# EAGLE design rev1.0 (EAGLE 9.2.2)
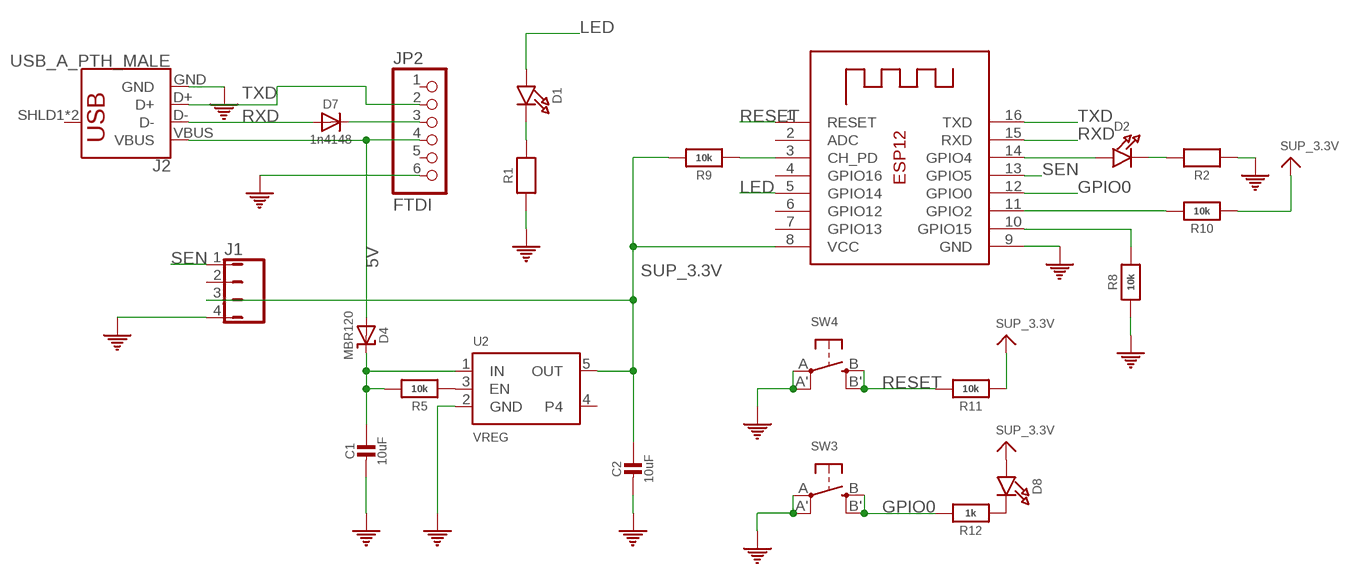
[diagram p0: schematic, sheet 1]

## Parts
C1  10uF  CAP_CERAMIC0805-NOOUTLINE  [0805-NO]
C2  10uF  CAP_CERAMIC0805-NOOUTLINE  [0805-NO]
D1  LED0805_NOOUTLINE  [CHIPLED_0805_NOOUTLINE]
D2  LED0805_NOOUTLINE  [CHIPLED_0805_NOOUTLINE]
D4  MBR120  DIODE-SCHOTTKYSOD-123  [SOD-123]
D7  1n4148  DIODESOD-323  [SOD-323]
D8  LED0805_NOOUTLINE  [CHIPLED_0805_NOOUTLINE]
J1  JMP/4P/SIP  [JMP/4P/SIP]
J2  USB_A_PTH_MALE  [USB-A-H]
JP2  FTDI  HEADER-1X670MIL  [1X06_ROUND_70]
R1  RESISTOR0805_NOOUTLINE  [0805-NO]
R2  RESISTOR0805_NOOUTLINE  [0805-NO]
R5  10k  RESISTOR0805_NOOUTLINE  [0805-NO]
R8  10k  RESISTOR0805_NOOUTLINE  [0805-NO]
R9  10k  RESISTOR0805_NOOUTLINE  [0805-NO]
R10  10k  RESISTOR0805_NOOUTLINE  [0805-NO]
R11  10k  RESISTOR0805_NOOUTLINE  [0805-NO]
R12  1k  RESISTOR0805_NOOUTLINE  [0805-NO]
SW3  SWITCH_TACT_SMT4.6X2.8  [BTN_KMR2_4.6X2.8]
SW4  SWITCH_TACT_SMT4.6X2.8  [BTN_KMR2_4.6X2.8]
U2  VREG  VREG_SOT23-5  [SOT23-5]
X1  ESP-12  [ESP-12]

## Nets
5V: D4.A J2.VBUS JP2.4
GND: C1.2 C2.2 J1.4 J2.GND JP2.6 R1.1 R2.1 R8.1 SW3.A'(P1) SW3.A(P) SW4.A'(P1) SW4.A(P) U2.2(GND) X1.9(GND)
GPIO0: R12.2 SW3.B'(S1) SW3.B(S) X1.12(GPIO0)
GPIO15: R8.2 X1.10(GPIO15)
LED: D1.A X1.5(GPIO14)
N$1: D1.C R1.2
N$2: D2.A X1.14(GPIO4)
N$3: D8.C R12.1
N$4: R5.1 U2.3(EN)
N$5: D7.C JP2.3
N$6: C1.1 D4.C R5.2 U2.1(IN)
N$7: D2.C R2.2
N$8: R10.2 X1.11(GPIO2)
N$9: R9.1 X1.3(CH_PD)
RESET: R11.2 SW4.B'(S1) SW4.B(S) X1.1(RESET)
RXD: D7.A J2.D- X1.15(RXD)
SEN: J1.1 X1.13(GPIO5)
SUP_3.3V: C2.1 D8.A J1.3 R9.2 R10.1 R11.1 U2.5(OUT) X1.8(VCC)
TXD: J2.D+ JP2.2 X1.16(TXD)
Unconnected: J1.2 J2.SHLD1(SHIELD) J2.SHLD2(SHIELD) JP2.1 JP2.5 U2.4 X1.2(ADC) X1.4(GPIO16) X1.6(GPIO12) X1.7(GPIO13)

## Library data of the parts
C1 C2 = ddh:CAP_CERAMIC: Ceramic Capacitors For new designs, use the packages preceded by an '_' character since they are more reliable: The following footprints should be used on most boards: _0402 - Standard footprint for regular board layouts _0603 - Standard footprint for regular board layouts _0805 - Standard footprint for regular board layouts _1206 - Standard footprint for regular board layouts For extremely tight-pitch boards where space is at a premium, the following 'micro-pitch' footprints can be used (smaller pads, no silkscreen outline, etc.): _0402MP - Micro-pitch footprint for very dense/compact boards _0603MP - Micro-pitch footprint for very dense/compact boards _0805MP - Micro-pitch footprint for very dense/compact boards _1206MP - Micro-pitch footprint for very dense/compact boards
D1 D2 D8 = ddh:LED: LED 0603 - 0603 Surface Mount Package 2mA: Green LED - Low Power (3.9mcd, 2ma, 1.7Vf) - Digikey: 475-2709-2-ND Orange LED - Low Power (9.8mcd, 2ma, 1.8Vf) - Digikey: 475-1194-2-ND Red LED - Low Power (5mcd, 2ma, 1.8Vf) - Digikey: 475-1195-2-ND Yellow LED - Low Power (7mcd, 2ma, 1.8Vf) - Digikey: 475-1196-2-ND 5mA: Blue LED - Low Power (17mcd, 5ma, 2.9Vf) - Digikey: LNJ937W8CRACT-ND 0805 - 0805 Surface Mount Package 2mA: Red LED (8.8mcd, 2mA, 1.8Vf, Clear) - Low Power [Digikey: 475-2510-1-ND] Green LED (5mcd, 2mA, 1.8Vf, Clear) - Low Power [Digikey: 475-2730-1-ND] Yellow LED (11.3mcd, 2mA, 1.8Vf, Clear) - Low Power [Digikey: 475-2555-1-ND] 20mA: Red LED (104mcd, 20mA, Diffused) - LS R976 [Digikey: 475-1278-6-ND] Red LED (12mcd, 20mA, 2.0Vf, Clear) - APT2012EC [Digikey: 754-1128-1-ND] Green LED (15mcd, 20mA, 2.2Vf, Clear) - APT2012GC [Digikey: 754-1131-1-ND] Orange LED (160mcd, 20mA, 2.1Vf, Clear) - APT2012SECK [Digikey: 754-1130-1-ND] 1206 - 1206 Surface Mount Package Green LED (26mcd, 20mA, Diffused) - LG N971 [Digikey: 475-1407-6-ND] Red LED (15mcd, 20mA, Diffused) - LH N974 [Digikey: 475-1416-6-ND] Cree - Cree High-Power Surface Mount LEDs XPEBWT-L1-0000-00D50 - White 111lm 350mA 2.9Vf 6200K 110° XTEAWT-00-0000-00000LEE3 - White 114lm 350mA 2.85Vf 5000K 115° Everlight - Everlight 45-21 Series Surface Mount LEDs 45-21/QK2C-B2832AC2CB2/2T - Warm White 2000mcd 20mA 3.25Vf 3050K 120° 45-21/LK2C-B38452C4CB2/2T - Nuetral White 2000mcd 20mA 3.25Vf 4150K 120° 45-21/LK2C-B50634C6CB2/2T - Cold White 2200mcd 20mA 3.25Vf 5650K 120° PLCC2 Reverse Mount LS T77K-J1L2-1-0-2-R18-Z - Red 11.25mcd 2mA 1.8Vf 630nm 120° LO T77K-L1M2-24-Z - Orange 19.6mcd 2mA 1.8Vf 606nm 120° LY T77K-K2M1-26-Z - Yellow 15.7mcd 2mA 1.8Vf 587nm 120°
D4 = ddh:DIODE-SCHOTTKY
D7 = ddh:DIODE: Diode SMA Model Volts Amps Type Vf Ir Digikey # Notes SSA34-E3 40V 3A Schottky 480mV @ 3A 200uA @ 40V SSA34-E3/61TGITR-ND CDBA120-G 20V 1A Schottky 500mV @ 1A 500uA @ 20V 641-1014-6-ND REEL MBRA210 10V 2A Schottky 350mV @ 2A 700uA @ 10V MBRA210LT3 SOD-123 Model Volts Amps Type Vf Ir Order # Notes BAT54T1G 30V 200mA Schottky 800mV @ 200mA 2uA @ 25V BAT54T1GOSTR-ND B0530W 30V 500mA Schottky 430mV @ 500mA 130uA @ 30V B0530W-FDICT-ND REEL MBR120 20V 1A Schottky 340mV @ 1A MBR120VLSFT1GOSCT-ND SOD-323 Model Volts Amps Type Vf Ir Order # Notes PMEG2005EJ 20V 500mA Schottky 355mV @ 500mA 568-4110-1-ND ZLLS410 10V 570mA Schottky 380mV @ 570mA ZLLS410CT-ND 1N4148WS 75V 150mA Silicon/Simple 1V 1N4148WSFSCT-ND REEL SOD-523 Model Volts Amps Type Vf Ir Order # Notes BAT54XV2 30V 200mA Schottky 0.8V @ 100mA BAT54XV2CT-ND TB751S 30V 30mA Schottky RB751S-40TE61CT-ND SOT23-R/W (R = Solder Paste/Reflow Ovens, W = Hand-Soldering) Model Volts Amps Type Vf Ir Order # Notes BAT54FILM 40V 300mA Schottky 497-7162-1-ND POWERDI-5 Model Volts Amps Type Vf Ir Order # Notes PDS560 60V 5A Schottky 670mV @ 5A 150uA @ 60V PDS560DICT-ND
J1 = audioint:JMP/4P/SIP
J2 = SparkFun-Connectors:USB_A: USB-A Connector Male and female variants, as well as PTH and SMT variants SparkFun Products: SparkFun XBee Explorer Dongle <https://www.sparkfun.com/products/11697> PTH Male SparkFun MicroView-USB Programmer <https://www.sparkfun.com/products/12924> SMT Male SparkFun USB Type A Female Breakout <https://www.sparkfun.com/products/12700> SMT Female; PROD_ID: CONN-08367; SF_ID: PRT-00437
JP2 = ddh:HEADER-1X6: PIN HEADER
R1 R2 R5 R8-R12 = ddh:RESISTOR: Resistors For new designs, use the packages preceded by an '_' character since they are more reliable: The following footprints should be used on most boards: _0402 - Standard footprint for regular board layouts _0603 - Standard footprint for regular board layouts _0805 - Standard footprint for regular board layouts _1206 - Standard footprint for regular board layouts For extremely tight-pitch boards where space is at a premium, the following 'micro-pitch' footprints can be used (smaller pads, no silkscreen outline, etc.): _0402MP - Micro-pitch footprint for very dense/compact boards _0603MP - Micro-pitch footprint for very dense/compact boards _0805MP - Micro-pitch footprint for very dense/compact boards _1206MP - Micro-pitch footprint for very dense/compact boards
SW3 SW4 = ddh:SWITCH_TACT_SMT: SMT Tact Switches 6x6mm - Digikey: P12940SCT-ND KMR2 (4.6x2.8mm) - Digikey: 401-1426-1-ND EVQ-PQHB55 - Light Touch, 160GF (4.5x4.5mm) - Digikey: P8090SCT-ND KMT0 - KMT021 NGJ LHS (etc.) IP68/Waterproof - Digikey: CKN10289CT-ND
U2 = ddh:VREG_SOT23-5: SOT23-5 Fixed Voltage Regulators Part Current Out V Out V In V Dropout θJA (°C/W) TJ (°C) Digikey Part No. ADP121 150mA 3.3V 3.4-5.5V 0.09V @ 150mA -- -- ADP121-AUJZ33R7CT-ND ADP121 150mA 3.0V 3.1-5.5V 0.09V @ 150mA -- -- ADP121-AUJZ30R7CT-ND ADP122 300mA 3.3V 3.4-5.5V 0.085V @ 300mA -- -- ADP122AUJZ-3.3-R7CT-ND ADP1712 300mA 3.3V 3.5-5.5V 0.17V @ 300mA -- -- ADP1712AUJZ-3.3-R7TR-ND AP7311 (Low Cost) 150mA 3.3V 3.5-6V 0.15V @ 150mA -- -- AP7311-33WG-7DICT-ND LD39015M18R 150mA 1.8V 1.9V-5.5V 0.08V @ 100mA -- -- 497-6977-1-ND LP2985A-33DBVR 150mA 3.3V 3.3-16V 0.28V @ 150mA 206 150 296-18479-1-ND MCP1824T-3302E/OT 300mA 3.3V 3.5V-6V 0.2V @ 300mA -- -- MCP1824T-3302E/OTCT-ND MIC5205-2.5YM5 TR 150mA 2.5V 2.7-16V 0.165V @ 150mA -- -- 576-1257-2-ND MIC5205-3.0YM5 TR 150mA 3.0V 3.2V-16V 0.165V @ 150mA -- -- 576-1258-2-ND MIC5205-3.3YM5 TR 150mA 3.3V 3.5V-16V 0.165V @ 150mA -- -- 576-1259-2-ND TPS780330220 150mA 3.3V+2.2V 3.6-5.5V 250mV Max -- -- 296-23332-1-ND TDA3663/N1,135 100mA 3.3V 3.5-45V 0.18V @ 50mA -- -- 568-5343-1-ND Max operating temp can be calculated using θJA, TJ (max junction temperature), and power in watts. Set the "Maximum Ambient Temperature" until it reaches TJ ("Max Junction Temperature"), which is the absolute limit for safe use of the regulator: Heat Sink Temperature Calculator <http://www.daycounter.com/Calculators/Heat-Sink-Temperature-Calculator.phtml> For example, With 12V source into a 3.3V LP2985 and a 30mA load, we are dissipating (12V-3.3V) * 0.03A = 0.261W. With a θJA of 206 °C/W, a TJ of 150°C, and 261mW we can safely use the chip without a heat sink up to 75°C (=147.1°C Junction Temperature).
X1 = ddh:ESP-12

## Board
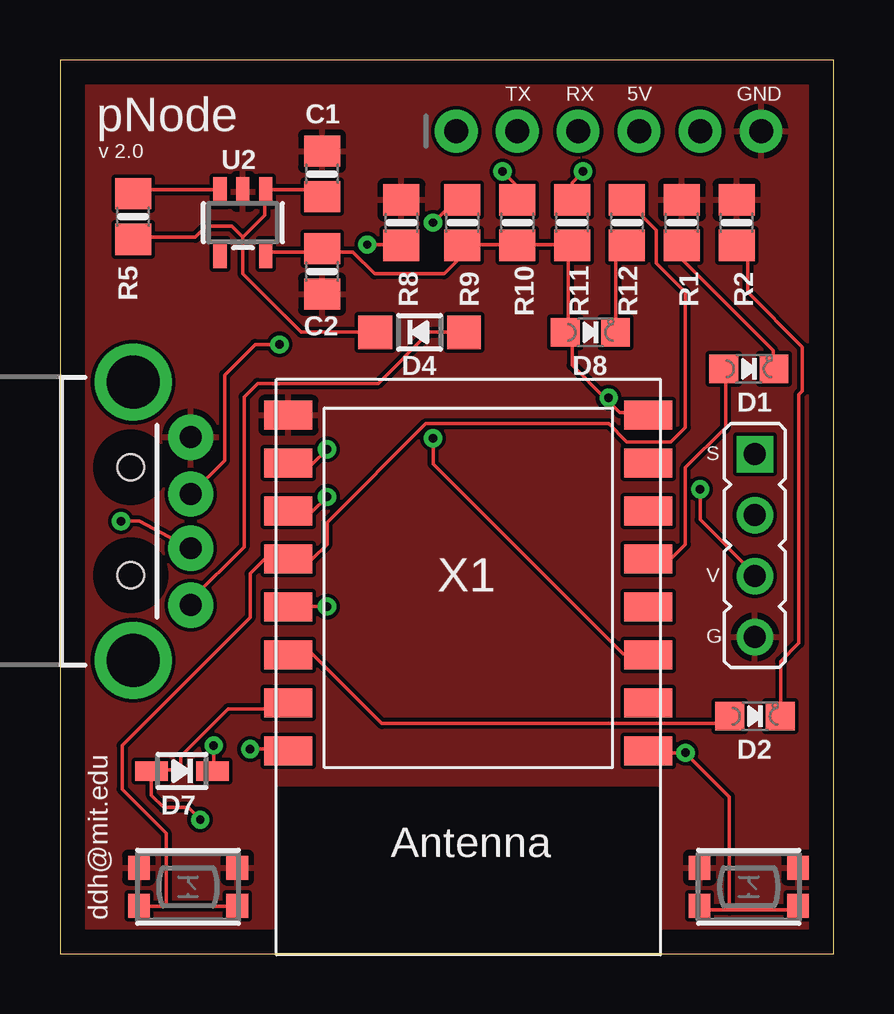
[diagram p1: board, top side]
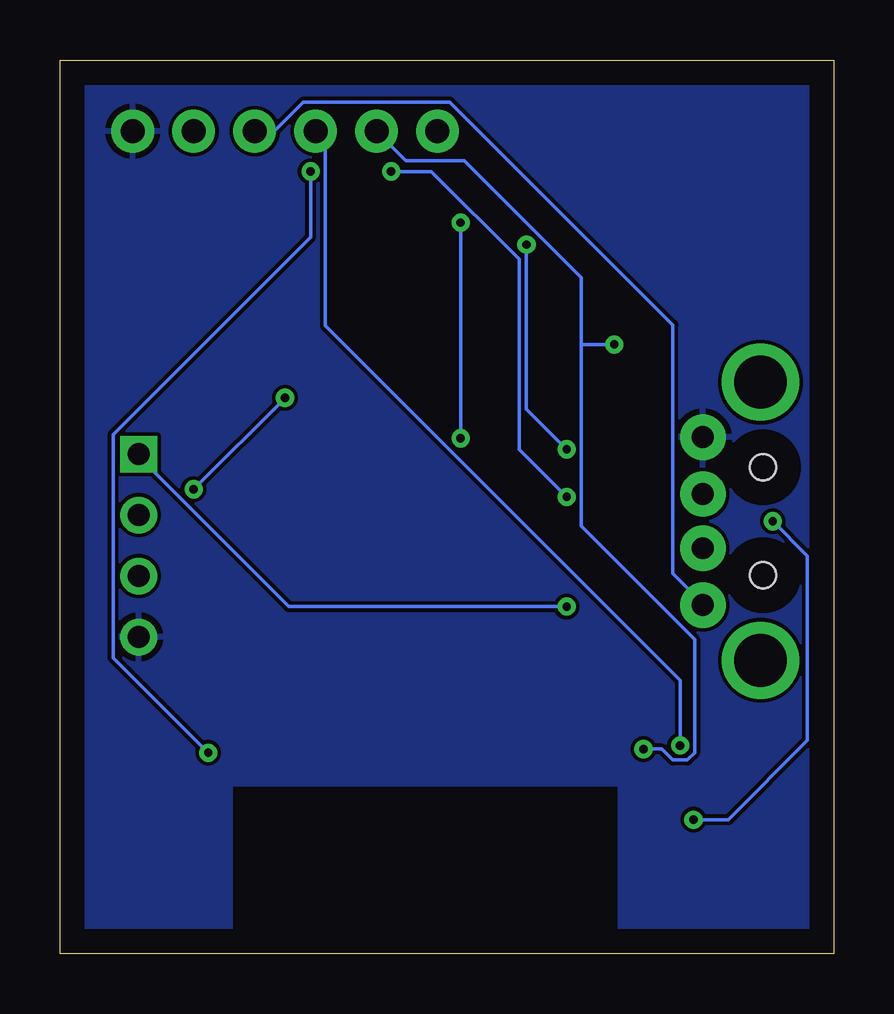
[diagram p2: board, bottom side, seen from below]

Size 32.24 x 37.26 mm. Coordinates in mm from the lower left corner, seen from the top.
Outline: 0,0 32.24,0 32.24,37.26 0,37.26 0,0
Copper layers (1*16): Top 0.035mm / dielectric 1.5mm / Bottom 0.035mm
Design rules "default": minimum track width 6mil, minimum drill 0.35mm, track to track 6mil, track to pad 6mil, pad to pad 6mil, via to via 6mil, smd to smd 6mil, copper to edge 40mil, drill to drill 6mil, minimum pad ring 10mil, minimum via ring 8mil, stop-mask expansion 4mil, vias tented up to drill 0mil, thermal gap 10mil

### Footprints (pad centres in the part's own frame; a part is rotated, then mirrored left to right if it is on the bottom)
0805-NO = smd 1.3 x 1.5: 1 -0.95,0; 2 0.95,0
CHIPLED_0805_NOOUTLINE = smd 1.2 x 1.2: A 0,-1.05; C 0,1.05
SOD-123 = smd 1.4 x 1.4: A 1.85,0; C -1.85,0
SOD-323 = smd 1.35 x 0.8: A 1.27,0; C -1.27,0
JMP/4P/SIP = drill 0.914 pad 1.524 square: 1 -3.81,0 | drill 0.914 pad 1.524: 2 -1.27,0; 3 1.27,0; 4 3.81,0
USB-A-H = drill 0.914 pad 1.88: D+ 2.4,1.127; D- 2.4,-1.127; GND 2.4,3.5; VBUS 2.4,-3.5 | drill 2.2: SHLD1 0,-5.8; SHLD2 0,5.8 | hole 1.1: -0.1,2.25; -0.1,-2.25
1X06_ROUND_70 = drill 1 pad 1.778: 1 -6.35,0; 2 -3.81,0; 3 -1.27,0; 4 1.27,0; 5 3.81,0; 6 6.35,0
BTN_KMR2_4.6X2.8 = smd 0.9 x 1: A 2.05,0.8; A' -2.05,0.8; B 2.05,-0.8; B' -2.05,-0.8
SOT23-5 = smd 0.55 x 1.2: 1 -0.95,-1.3; 2 0,-1.3; 3 0.95,-1.3; 4 0.95,1.3; 5 -0.95,1.3
ESP-12 = smd 2 x 1.2: 1 -7.5,4.5; 2 -7.5,2.5; 3 -7.5,0.5; 4 -7.5,-1.5; 5 -7.5,-3.5; 6 -7.5,-5.5; 7 -7.5,-7.5; 8 -7.5,-9.5; 9 7.5,-9.5; 10 7.5,-7.5; 11 7.5,-5.5; 12 7.5,-3.5; 13 7.5,-1.5; 14 7.5,0.5; 15 7.5,2.5; 16 7.5,4.5

### Placement (x,y rotation side)
C1  10.92,32.51 90 top
C2  10.92,28.45 270 top
D1  28.7,24.38 270 top
D2  28.96,9.91 270 top
D4  14.99,25.91 0 top
D7  5.08,7.62 180 top
D8  22.1,25.91 270 top
J1  28.96,17.02 270 top
J2  3.05,18.03 0 top
JP2  22.86,34.29 0 top
R1  25.91,30.48 270 top
R2  28.19,30.48 270 top
R5  3.05,30.73 270 top
R8  14.22,30.48 270 top
R9  16.76,30.48 270 top
R10  19.05,30.48 90 top
R11  21.34,30.48 90 top
R12  23.62,30.48 90 top
SW3  5.33,2.79 0 top
SW4  28.7,2.79 0 top
U2  7.62,30.48 180 top
X1  17.02,12.95 180 top

### Tracks (layer width: path | path; a pad name or v marks a point on that pad's centre or on a via)
5V
  Top 0.152: D4.A 15.39,25.91 13.26,23.77 8.23,23.77 7.67,23.22 7.67,16.97 5.45,14.74 J2.VBUS
  Bottom 0.152: JP2.4 23.32,34.29 22.1,35.51 16,35.51 6.71,26.21 6.71,15.85 5.49,14.63 J2.VBUS
GND
  pour Bottom: 0,0 32.26,0 32.26,37.34 0,37.34
  pour Top: 0,-0.05 32.26,-0.05 32.26,37.29 0,37.29
GPIO0
  Top 0.152: 4.42,1.98 7.32,1.98 SW3.B | 4.42,1.98 3.35,1.98 SW3.B' | R12.2 23.62,31.39 24.84,30.18 24.84,28.8 26.06,27.58 26.06,21.95 25.45,21.34 23.62,21.34 22.86,22.1 15.24,22.1 11.12,17.98 11.12,17.07 10.52,16.46 9.6,16.46 X1.12 9.45,16.46 8.53,16.46 7.92,15.85 7.92,14.02 2.59,8.69 2.59,6.86 4.42,5.03 4.42,1.98
GPIO15  (via drill 0.35)
  Top 0.152: v12.8,29.57 14.17,29.57 R8.2 | v11.12,21.03 10.52,20.42 9.6,20.42 X1.10
  Bottom 0.152: v12.8,29.57 12.8,22.71 v11.12,21.03
LED
  Top 0.152: D1.A 27.74,24.38 27.74,21.95 26.06,20.27 26.06,17.07 25.45,16.46 24.54,16.46 X1.5
N$1
  Top 0.152: R1.2 25.91,28.96 29.72,25.15 29.72,24.38 D1.C
N$2
  Top 0.152: X1.14 9.6,12.5 10.52,12.5 13.41,9.6 27.8,9.6 27.8,9.8 D2.A
N$3
  Top 0.152: D8.C 23.16,25.91 23.16,28.96 23.62,29.41 R12.1
N$4
  Top 0.152: U2.3 6.55,31.85 3.2,31.85 3.05,31.7 R5.1
N$5  (via drill 0.35)
  Top 0.152: v6.4,8.69 6.4,7.62 D7.C
  Bottom 0.152: v6.4,8.69 6.4,11.4 21.18,26.19 21.18,33.98 21.49,34.29 JP2.3
N$6
  Top 0.152: C1.1 10.82,31.7 10.67,31.85 8.69,31.85 U2.1 8.53,31.7 8.53,30.79 7.62,29.87 | D4.C 10.06,25.91 7.62,28.35 7.62,29.87 | 7.62,29.87 7.16,30.33 6.1,30.33 5.64,29.87 3.05,29.87 R5.2
N$7
  Top 0.152: D2.C 30.02,9.96 30.02,12.19 30.79,12.95 30.79,23.32 30.94,23.47 30.94,25.3 28.65,27.58 28.65,28.96 28.19,29.41 R2.2
N$8  (via drill 0.35)
  Top 0.152: R10.2 19.05,32 v18.44,32.61 | v11.12,19.05 10.52,18.44 9.6,18.44 X1.11
  Bottom 0.152: v18.44,32.61 16.76,32.61 13.11,28.96 13.11,21.03 v11.12,19.05
N$9  (via drill 0.35)
  Top 0.152: v15.54,30.48 16.46,31.39 16.76,31.39 R9.1 | v15.54,21.49 15.54,20.42 23.47,12.5 24.38,12.5 X1.3
  Bottom 0.152: v15.54,21.49 v15.54,30.48
RESET  (via drill 0.35)
  Top 0.152: 27.89,1.83 30.53,1.83 SW4.B | 27.89,1.83 26.68,1.83 SW4.B' | R11.2 21.34,32.16 v21.79,32.61 | X1.1 24.54,8.38 v26.06,8.38 27.89,6.55 27.89,1.83
  Bottom 0.152: v21.79,32.61 21.79,29.87 30.02,21.64 30.02,12.34 v26.06,8.38
RXD  (via drill 0.35)
  Top 0.152: X1.15 9.45,10.36 9.3,10.21 7.01,10.21 5.03,8.23 5.03,7.92 4.78,7.67 3.86,7.67 D7.A 3.81,6.6 4.32,6.1 5.33,6.1 v5.84,5.59 | J2.D- 3.3,18.03 v2.54,18.03
  Bottom 0.152: v2.54,18.03 1.09,16.59 1.09,8.89 4.39,5.59 v5.84,5.59
SEN  (via drill 0.35)
  Top 0.152: v11.12,14.48 9.6,14.48 X1.13
  Bottom 0.152: v11.12,14.48 22.71,14.48 28.96,20.73 J1.1
SUP_3.3V  (via drill 0.35)
  Top 0.152: U2.5 8.69,29.26 10.82,29.26 C2.1 10.97,29.26 12.19,29.26 13.11,28.35 16,28.35 16.76,29.11 R9.2 16.76,29.57 19.05,29.57 | 21.18,25.91 21.18,29.26 21.34,29.41 R11.1 21.34,29.57 19.05,29.57 | 22.7,23.17 21.34,24.54 21.34,25.76 21.18,25.91 | 22.7,23.17 23.32,22.55 24.38,22.55 X1.8 | 21.18,25.91 D8.A | 19.05,29.57 R10.1 | v26.67,19.37 26.67,18.1 28.89,15.88 J1.3 | v22.86,23.18 22.7,23.18 22.7,23.17
  Bottom 0.152: v22.86,23.18 v26.67,19.37
TXD  (via drill 0.35)
  Top 0.152: v7.92,8.53 9.45,8.53 X1.16 | J2.D+ 6.86,20.57 6.86,24.13 8.13,25.4 v9.14,25.4
  Bottom 0.152: v7.92,8.53 7.16,8.53 6.71,8.08 6.1,8.08 5.79,8.38 5.79,13.11 10.52,17.83 10.52,25.4 | 10.52,25.4 10.52,28.19 15.39,33.07 17.83,33.07 JP2.2 | v9.14,25.4 10.52,25.4

### Text on the board
tNames: TX | RX | 5V | GND | pNode | v 2.0 | S | V | G | ddh@mit.edu